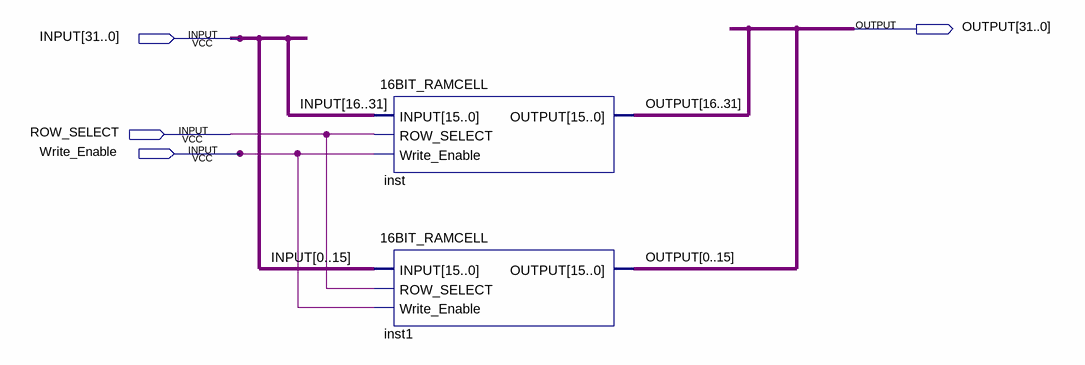
[diagram p0: schematic sheet]
// Quartus schematic 32BIT-RAMCELL.bdf as structural Verilog: 2 symbols, 4 pins
module \32BIT-RAMCELL  (
  input  [31:0] INPUT,
  input  ROW_SELECT,
  input  Write_Enable,
  output [31:0] OUTPUT
);

  \16BIT_RAMCELL  inst (
    .INPUT({INPUT[16], INPUT[17], INPUT[18], INPUT[19], INPUT[20], INPUT[21], INPUT[22], INPUT[23], INPUT[24], INPUT[25], INPUT[26], INPUT[27], INPUT[28], INPUT[29], INPUT[30], INPUT[31]}),
    .ROW_SELECT(ROW_SELECT), .Write_Enable(Write_Enable),
    .OUTPUT({OUTPUT[16], OUTPUT[17], OUTPUT[18], OUTPUT[19], OUTPUT[20], OUTPUT[21], OUTPUT[22], OUTPUT[23], OUTPUT[24], OUTPUT[25], OUTPUT[26], OUTPUT[27], OUTPUT[28], OUTPUT[29], OUTPUT[30], OUTPUT[31]}));
  \16BIT_RAMCELL  inst1 (
    .INPUT({INPUT[0], INPUT[1], INPUT[2], INPUT[3], INPUT[4], INPUT[5], INPUT[6], INPUT[7], INPUT[8], INPUT[9], INPUT[10], INPUT[11], INPUT[12], INPUT[13], INPUT[14], INPUT[15]}),
    .ROW_SELECT(ROW_SELECT), .Write_Enable(Write_Enable),
    .OUTPUT({OUTPUT[0], OUTPUT[1], OUTPUT[2], OUTPUT[3], OUTPUT[4], OUTPUT[5], OUTPUT[6], OUTPUT[7], OUTPUT[8], OUTPUT[9], OUTPUT[10], OUTPUT[11], OUTPUT[12], OUTPUT[13], OUTPUT[14], OUTPUT[15]}));
endmodule
